# Altium schematic sheet Main.SchDoc
size A4
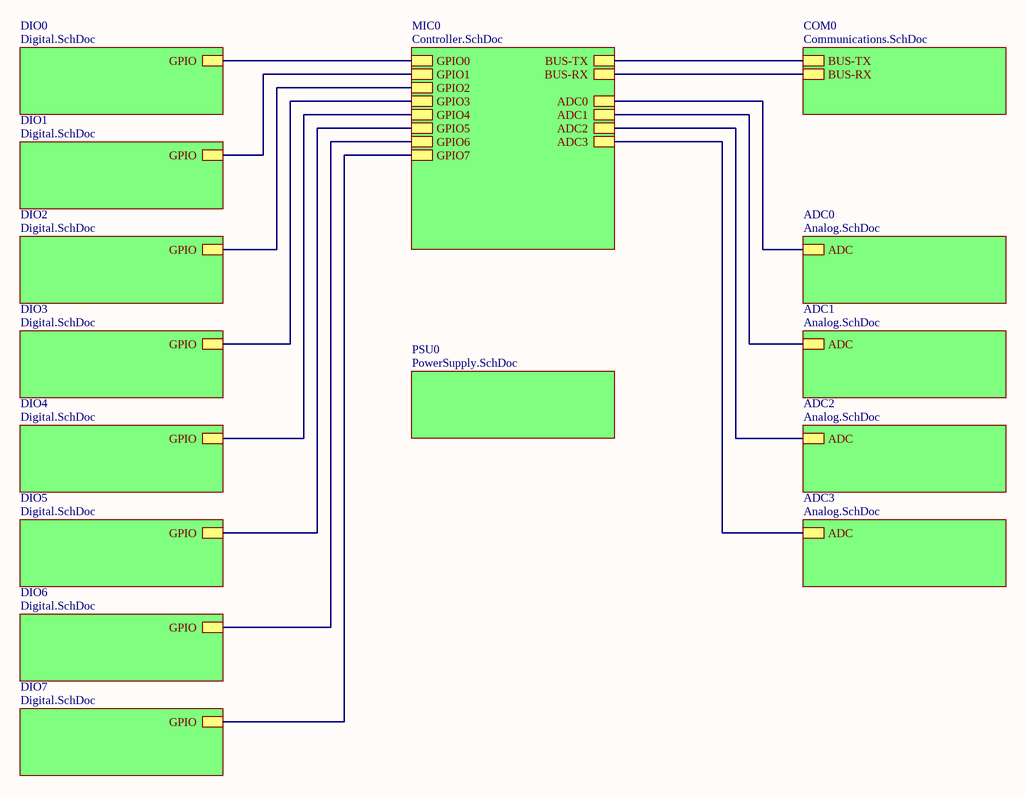
[diagram p0: Main.SchDoc]

## Sub-sheets
ADC0 = Analog.SchDoc: ADC
ADC1 = Analog.SchDoc: ADC
ADC2 = Analog.SchDoc: ADC
ADC3 = Analog.SchDoc: ADC
COM0 = Communications.SchDoc: BUS-TX, BUS-RX
DIO0 = Digital.SchDoc: GPIO
DIO1 = Digital.SchDoc: GPIO
DIO2 = Digital.SchDoc: GPIO
DIO3 = Digital.SchDoc: GPIO
DIO4 = Digital.SchDoc: GPIO
DIO5 = Digital.SchDoc: GPIO
DIO6 = Digital.SchDoc: GPIO
DIO7 = Digital.SchDoc: GPIO
MIC0 = Controller.SchDoc: BUS-TX, BUS-RX, GPIO0, GPIO7, GPIO6, GPIO5, GPIO4, GPIO3, GPIO2, GPIO1, ADC0, ADC1, ADC2, ADC3
PSU0 = PowerSupply.SchDoc: no entries

## Nets
(unnamed): sheet ADC0/ADC, sheet MIC0/ADC0
(unnamed): sheet ADC1/ADC, sheet MIC0/ADC1
(unnamed): sheet COM0/BUS-TX, sheet MIC0/BUS-TX
(unnamed): sheet COM0/BUS-RX, sheet MIC0/BUS-RX
(unnamed): sheet MIC0/GPIO0, sheet DIO0/GPIO
(unnamed): sheet MIC0/GPIO7, sheet DIO7/GPIO
(unnamed): sheet MIC0/GPIO6, sheet DIO6/GPIO
(unnamed): sheet MIC0/GPIO5, sheet DIO5/GPIO
(unnamed): sheet MIC0/GPIO4, sheet DIO4/GPIO
(unnamed): sheet MIC0/GPIO3, sheet DIO3/GPIO
(unnamed): sheet MIC0/GPIO2, sheet DIO2/GPIO
(unnamed): sheet MIC0/GPIO1, sheet DIO1/GPIO
(unnamed): sheet MIC0/ADC2, sheet ADC2/ADC
(unnamed): sheet MIC0/ADC3, sheet ADC3/ADC